# EAGLE schematic dual power supply (EAGLE 9.6.2)
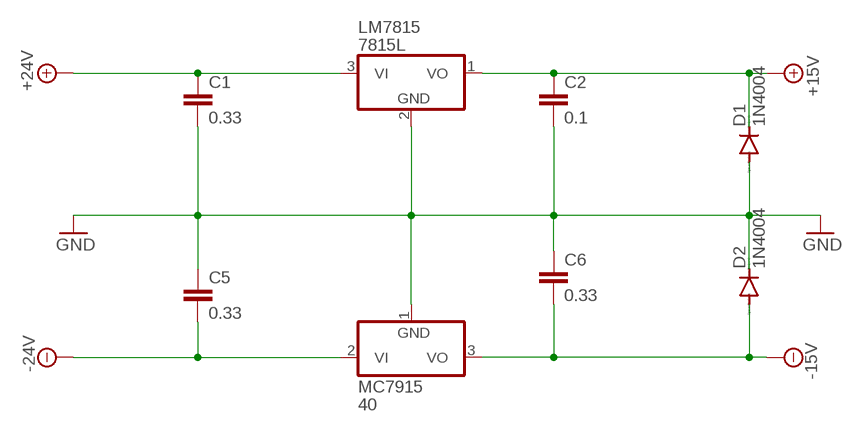
[diagram p0: schematic, sheet 1]

## Parts
C1  0.33  C2,5-3  [C2.5-3]
C2  0.1  C2,5-3  [C2.5-3]
C5  0.33  C2,5-3  [C2.5-3]
C6  0.33  C2,5-3  [C2.5-3]
D1  1N4004  [DO41-10]
D2  1N4004  [DO41-10]
LM7815  7815L  [TO92]
MC7915  40  7915L  [TO92]

## Nets
+15V: C2.1 D1.C LM7815.1(VO)
+24V: C1.1 LM7815.3(VI)
-15V: C6.2 D2.A MC7915.3(VO)
-24V: C5.2 MC7915.2(VI)
GND: C1.2 C2.2 C5.1 C6.1 D1.A D2.C LM7815.2(GND) MC7915.1(GND)

## Library data of the parts
C1 C2 C5 C6 = capacitor-wima:C: CAPACITOR naming: grid - package width
D1 D2 = diode:1N4004: DIODE general purpose rectifier, 1 A
LM7815 = linear:78*: Positive VOLTAGE REGULATOR Source: http://cache.national.com/ds/LM/LM78L05.pdf http://www.fairchildsemi.com/ds/LM/LM7805.pdf
MC7915 = linear:79*: Negative VOLTAGE REGULATOR